# EAGLE design Pure Noise (EAGLE 8.7.0)
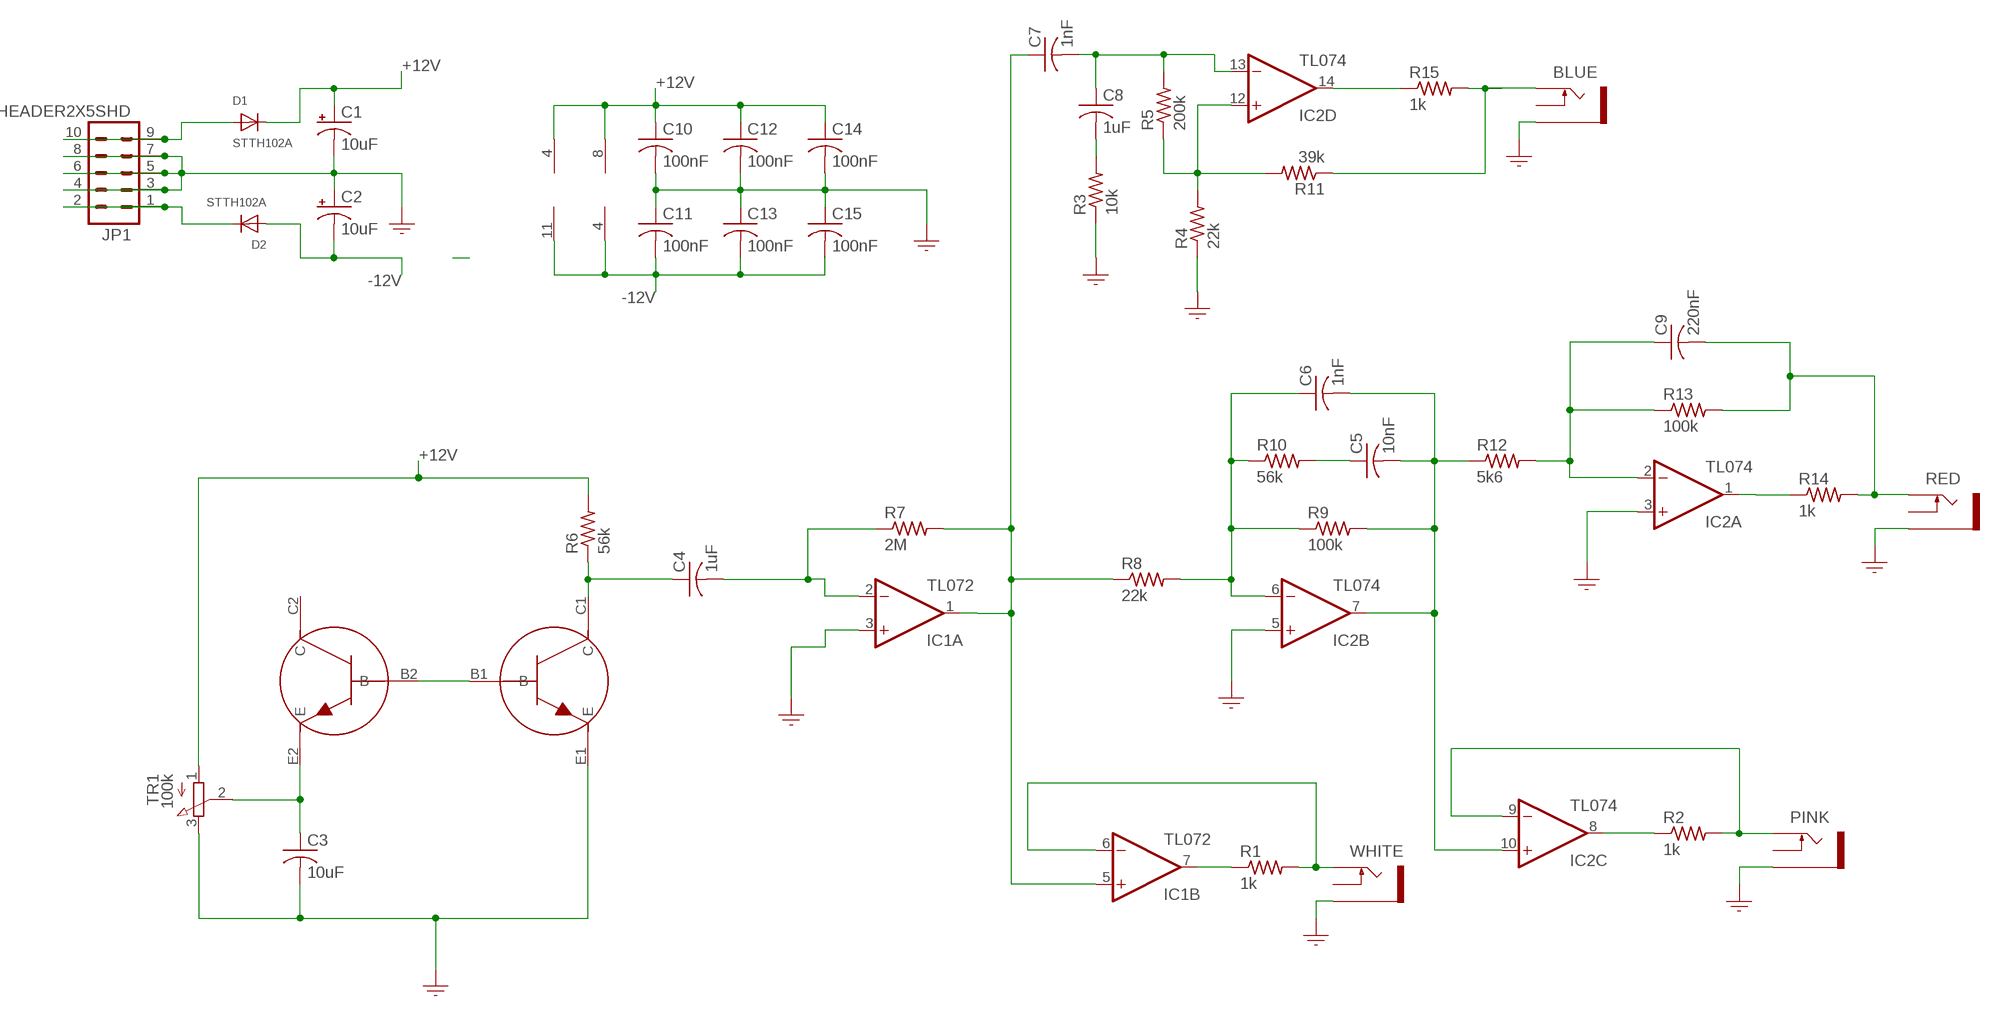
[diagram p0: schematic, sheet 1]

## Parts
BLUE  SOCKET_MONO_3.5MMPJ301M-12  [PJ301M-12]
C1  10uF  CAPACITOR_POL-US153CLV-0505  [153CLV-0505]
C2  10uF  CAPACITOR_POL-US153CLV-0505  [153CLV-0505]
C3  10uF  CAPACITOR-USC0805  [C0805]
C4  1uF  CAPACITOR-USC0805  [C0805]
C5  10nF  CAPACITOR-USC0805  [C0805]
C6  1nF  CAPACITOR-USC0805  [C0805]
C7  1nF  CAPACITOR-USC0805  [C0805]
C8  1uF  CAPACITOR-USC0805  [C0805]
C9  220nF  CAPACITOR-USC0805  [C0805]
C10  100nF  CAPACITOR-USC0805  [C0805]
C11  100nF  CAPACITOR-USC0805  [C0805]
C12  100nF  CAPACITOR-USC0805  [C0805]
C13  100nF  CAPACITOR-USC0805  [C0805]
C14  100nF  CAPACITOR-USC0805  [C0805]
C15  100nF  CAPACITOR-USC0805  [C0805]
D1  STTH102A  DIODESMA  [SMADIODE]
D2  STTH102A  DIODESMA  [SMADIODE]
IC1  TL072  OPAMP_DUALD  [SO08]
IC2  TL074  OPAMP_QUADD  [SO14]
JP1  HEADER2X5SHD  [2X5-SHROUDED]
PINK  SOCKET_MONO_3.5MMPJ301M-12  [PJ301M-12]
R1  1k  RESISTOR_USR0805  [R0805]
R2  1k  RESISTOR_USR0805  [R0805]
R3  10k  RESISTOR_USR0805  [R0805]
R4  22k  RESISTOR_USR0805  [R0805]
R5  200k  RESISTOR_USR0805  [R0805]
R6  56k  RESISTOR_USR0805  [R0805]
R7  2M  RESISTOR_USR0805  [R0805]
R8  22k  RESISTOR_USR0805  [R0805]
R9  100k  RESISTOR_USR0805  [R0805]
R10  56k  RESISTOR_USR0805  [R0805]
R11  39k  RESISTOR_USR0805  [R0805]
R12  5k6  RESISTOR_USR0805  [R0805]
R13  100k  RESISTOR_USR0805  [R0805]
R14  1k  RESISTOR_USR0805  [R0805]
R15  1k  RESISTOR_USR0805  [R0805]
RED  SOCKET_MONO_3.5MMPJ301M-12  [PJ301M-12]
T1  DMMT3904W-7-F  TRANSISTOR_PAIR_NPN  [TRANS_PAIR]
TR1  100k  RESISTOR_VARIABLETRIMMER_TH  [TRIMMER_TH]
WHITE  SOCKET_MONO_3.5MMPJ301M-12  [PJ301M-12]

## Nets
+12V: C1.+ C10.1 C12.1 C14.1 D1.C IC1.8(P:V+) IC2.4(P:V+) R6.2 TR1.1
-12V: C2.- C11.2 C13.2 C15.2 D2.A IC1.4(P:V-) IC2.11(P:V-)
BLUE: BLUE.TIP R11.1 R15.2
GND: BLUE.GND(SLEEVE) C1.- C2.+ C3.2 C10.2 C11.1 C12.2 C13.1 C14.2 C15.1 IC1.3(A:+IN) IC2.3(A:+IN) IC2.5(B:+IN) JP1.3 JP1.4 JP1.5 JP1.6 JP1.7 JP1.8 PINK.GND(SLEEVE) R3.1 R4.1 RED.GND(SLEEVE) T1.E1(E) TR1.3 WHITE.GND(SLEEVE)
N$1: IC1.7(B:OUT) R1.1
N$2: IC2.8(C:OUT) R2.1
N$3: C8.2 R3.2
N$4: C7.2 C8.1 IC2.13(D:-IN) R5.2
N$5: IC2.12(D:+IN) R4.2 R5.1 R11.2
N$6: C9.1 IC2.2(A:-IN) R12.2 R13.1
N$8: IC2.1(A:OUT) R14.1
N$9: D1.A JP1.9 JP1.10
N$10: D2.C JP1.1 JP1.2
N$11: IC2.14(D:OUT) R15.1
N$12: T1.B1(B) T1.B2(B)
N$13: C3.1 T1.E2(E) TR1.2
N$14: C4.1 R6.1 T1.C1(C)
N$15: C4.2 IC1.2(A:-IN) R7.1
N$16: C6.1 IC2.6(B:-IN) R8.2 R9.1 R10.1
N$17: C5.1 R10.2
N$19: C7.1 IC1.1(A:OUT) IC1.5(B:+IN) R7.2 R8.1
N$23: C5.2 C6.2 IC2.7(B:OUT) IC2.10(C:+IN) R9.2 R12.1
PINK: IC2.9(C:-IN) PINK.TIP R2.2
RED: C9.2 R13.2 R14.2 RED.TIP
WHITE: IC1.6(B:-IN) R1.2 WHITE.TIP
Unconnected: BLUE.NORM(SWITCH) PINK.NORM(SWITCH) RED.NORM(SWITCH) T1.C2(C) WHITE.NORM(SWITCH)

## Library data of the parts
BLUE PINK RED WHITE = GMSN:SOCKET_MONO_3.5MM: 3.5 mm Jack Socket; SORT: 8
C1 C2 = GMSN:CAPACITOR_POL-US: Electro Capacitor; SORT: 6
C3-C15 = GMSN:CAPACITOR-US: Capacitor; SORT: 3
D1 D2 = GMSN:DIODE: Diode SMADIODE - SMA Surface Mount Package 20V 1A Schottky Diode Digikey: 641-1014-6-ND DO-1N4148 - Through Hole Small Current Diode SOD-123 20V 1 A (.5mV Vf) Schottky Diode - Digikey: MBRX120TPMSCT-ND SOD-323 10V 570mA (.38mV Vf, 3ns) Schottky Diode - Digikey: ZLLS410CT-ND SOD-523 30V 30mA Schottky Diode (RB751S-40TE61) - Digikey: RB751S-40TE61CT-ND SOT23-R/W - SOT23 Package (R = Solder Paste/Reflow Ovens, W = Hand-Soldering) BAT54Film 40V 300mA - Digikey: 497-7162-1-ND; SORT: 1
IC1 = GMSN:OPAMP_DUAL: OP AMP; SORT: 4
IC2 = GMSN:OPAMP_QUAD: OP AMP; SORT: 4
JP1 = GMSN:HEADER2X5: Header 5x2 Standard 10-pin dual row 0.1" header. Commonly used with AVR-ISP. Use with Spark Fun Electronics SKU: PRT-00778; SORT: 7
R1-R15 = GMSN:RESISTOR_US: Resistor; SORT: 2
T1 = GMSN:TRANSISTOR_PAIR_NPN: NPN Transistor Matched Pair; SORT: 4
TR1 = GMSN:RESISTOR_VARIABLE: Potentiometer; SORT: 7

## Board
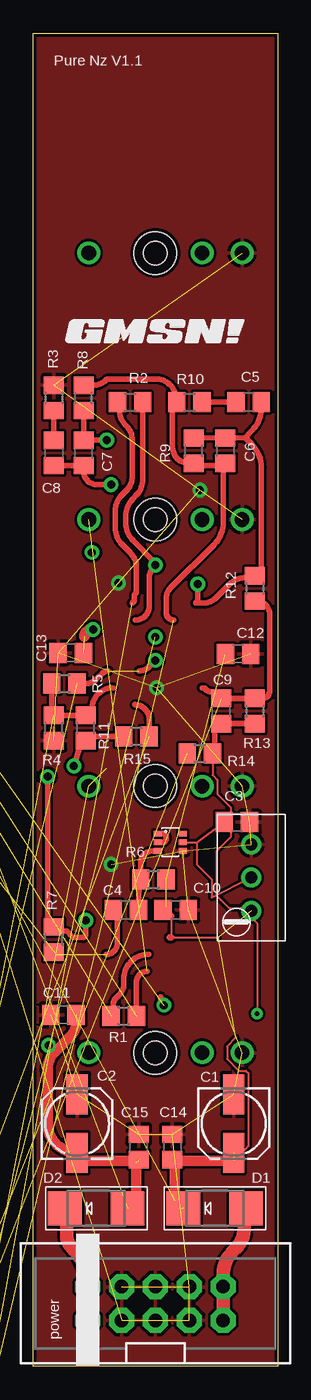
[diagram p1: board, top side]
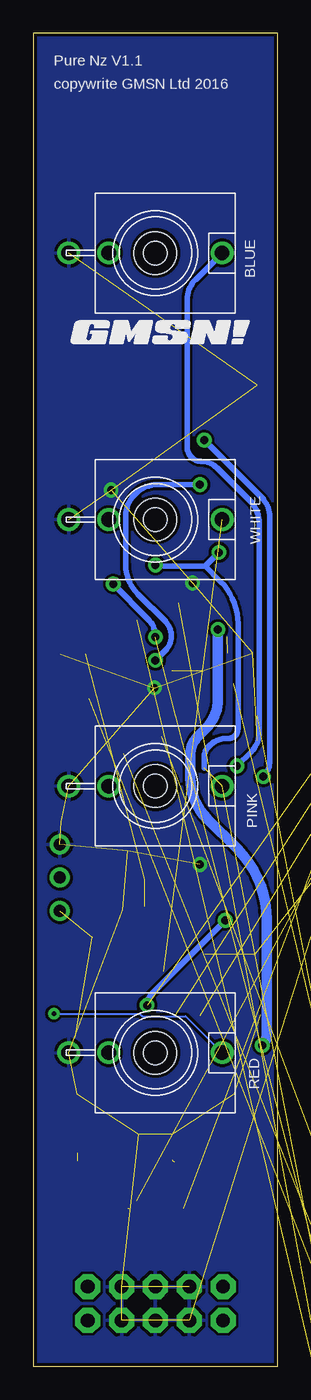
[diagram p2: board, bottom side, seen from below]

Size 18.32 x 100 mm. Coordinates in mm from the lower left corner, seen from the top.
Outline: 18.32,0 0,0 0,100 18.32,100 18.32,0
Copper layers (1*16): Top 0.035mm / dielectric 1.5mm / Bottom 0.035mm
Design rules "SparkFun": minimum track width 8mil, minimum drill 20mil, track to track 8mil, track to pad 8mil, pad to pad 8mil, via to via 8mil, smd to smd 8mil, copper to edge 10mil, drill to drill 8mil, minimum pad ring 12mil, minimum via ring 10mil, stop-mask expansion 4mil, vias tented up to drill 25mil, thermal gap 10mil
Holes 3.2 mm at 9.16,83.52 9.16,63.52 9.16,43.52 9.16,23.52

### Footprints (pad centres in the part's own frame; a part is rotated, then mirrored left to right if it is on the bottom)
PJ301M-12 = drill 1.1: GND 0,-6.5; NORM 0,-3.5; TIP 0,5 | hole 1.778: 0,0
153CLV-0505 = smd 3 x 1.6: + 2.2,0; - -2.2,0
C0805 = smd 1.3 x 1.5: 1 -0.95,0; 2 0.95,0
SMADIODE = smd 2.54 x 2.54: A 2.349,0; C -2.349,0
SO08 = smd 0.6 x 2.2: 1 -1.905,-2.6; 2 -0.635,-2.6; 3 0.635,-2.6; 4 1.905,-2.6; 5 1.905,2.6; 6 0.635,2.6; 7 -0.635,2.6; 8 -1.905,2.6
SO14 = smd 0.6 x 2.2: 1 -3.81,-2.6; 2 -2.54,-2.6; 3 -1.27,-2.6; 4 0,-2.6; 5 1.27,-2.6; 6 2.54,-2.6; 7 3.81,-2.6; 8 3.81,2.6; 9 2.54,2.6; 10 1.27,2.6; 11 0,2.6; 12 -1.27,2.6; 13 -2.54,2.6; 14 -3.81,2.6
2X5-SHROUDED = drill 1.016 pad 1.88 octagon: 1 -1.27,5.08; 2 1.27,5.08; 3 -1.27,2.54; 4 1.27,2.54; 5 -1.27,0; 6 1.27,0; 7 -1.27,-2.54; 8 1.27,-2.54; 9 -1.27,-5.08; 10 1.27,-5.08
R0805 = smd 1.3 x 1.5: 1 -0.95,0; 2 0.95,0
TRANS_PAIR = smd 0.42 x 0.6: B1 0,-0.95; B2 -0.65,-0.95; C1 0.65,-0.95; C2 -0.65,0.95; E1 0.65,0.95; E2 0,0.95
TRIMMER_TH = drill 0.9: 1 -0.802,1.143; 2 -3.302,1.143; 3 -5.802,1.143

### Placement (x,y rotation side)
BLUE  9.16,83.52 270 bottom
C1  15.03,18.19 270 top
C2  3.29,18.19 90 top
C3  15.27,40.82 0 top
C4  6.94,34.23 180 top
C5  16.14,72.33 0 top
C6  14.4,68.68 90 top
C7  3.76,68.52 270 top
C8  1.54,68.52 90 top
C9  14.08,49.15 270 top
C10  10.67,34.23 0 top
C11  2.25,26.37 0 top
C12  15.35,53.44 0 top
C13  2.81,53.52 0 top
C14  10.43,16.45 90 top
C15  7.89,16.45 270 top
D1  13.61,11.84 0 top
D2  4.71,11.84 0 top
IC1  -6.08,44.23 0 top  (outside the outline)
IC2  -8.62,-11.65 0 top  (outside the outline)
JP1  9.16,4.7 90 top
PINK  9.16,43.52 270 bottom
R1  6.78,26.29 0 top
R2  7.26,72.33 0 top
R3  1.54,72.65 270 top
R4  1.54,47.88 90 top
R5  2.33,51.21 0 top
R6  9,36.53 0 top
R7  1.54,32.01 90 top
R8  3.76,72.65 90 top
R9  12.02,68.68 90 top
R10  11.7,72.33 0 top
R11  3.92,47.88 90 top
R12  16.62,58.36 270 top
R13  16.62,49.15 270 top
R14  12.49,45.98 0 top
R15  7.73,47.25 180 top
RED  9.16,23.52 270 bottom
T1  10.27,39.31 270 top
TR1  15.19,33.36 270 top
U$2  [GMSN!_LOGO]  8.53,77.49 0 bottom
U$3  [GMSN!_LOGO]  9.4,77.57 0 top
WHITE  9.16,63.52 270 bottom

### Tracks (layer width: path | path; a pad name or v marks a point on that pad's centre or on a via)
+12V  (8 unrouted)
  Top 0.152: 10.35,32.17 13.88,32.17 | 15.19,24.66 14.53,23.99 14.53,23.05 15.4,22.17 15.95,22.17 16.11,22.01 16.11,16.5 15.03,15.42 | 10.35,33.8 10.35,32.29 10.22,32.17 | 9.95,34.51 C10.1
  Top 0.5: 10.22,32.17 10.35,32.17 | C10.1 10.35,33.8
  Top 0.8: 11.14,11.84 10.59,12.4 10.59,15.29 C14.1 10.46,15.42 15.03,15.42
-12V  (via drill 0.6)  (6 unrouted)
  Top 0.8: 7.73,15.29 7.73,11.92 7.65,11.84 D2.A | 7.86,15.42 3.37,15.42 3.29,15.5 C2.- 3.23,16.05 arc-90 1.06,18.22 1.06,22.23 arc-45 1.63,23.61 1.74,23.71 | 3.25,25.87 arc-45 2.8,24.77 1.74,23.71 | 3.81,54.75 arc-45 4.15,55.25 v4.48,55.26 | v1.14,24.07 1.5,23.71 1.74,23.71
  Bottom 0.8: v4.48,55.26 4.48,50.04 arc45 5.38,47.85 5.97,47.26 arc-45 6.54,45.89 6.54,44.11 arc-45 5.28,41.06 3.04,38.83 arc45 0.83,33.47 0.83,24.83 arc45 v1.14,24.07
BLUE  (via drill 0.6)
  Top 0.4: R15.2 4.24,47.25 R11.1 3.52,46.53 v3.05,45.02
  Bottom 0.4: v3.05,45.02 1.99,46.08 arc-45 1.38,47.55 1.38,63.22 arc-45 2.1,64.95 4.55,67.4 arc-45 5.71,67.88 arc90 6.78,68.95 6.78,80.01 arc45 6.15,81.53 BLUE.TIP
GND  (via drill 0.6)  (29 unrouted)
  other vias: 5.83,37.64 9.24,50.9 6.38,58.76 12.49,65.74
  pour Top: 18.32,100 0,100 0,0 18.32,0
  pour Bottom: 18.32,100 0,100 0,0 18.32,0
N$1  (1 unrouted)
  Top 0.4: 8.64,30.89 arc90 6.78,29.04 6.78,28.62 arc-45 6.48,27.89 6.2,27.62 arc45 5.99,27.09 5.99,26.45 R1.1
N$2  (1 unrouted)
  Top 0.4: 6.14,72.01 6.3,72.17 R2.1 6.46,72.17 6.46,71.68 arc45 6.9,70.62 6.99,70.53 arc-45 7.41,69.51 7.41,66.74 arc-45 6.99,65.71 6.61,65.33 arc45 6.14,64.21 6.14,62.89 arc45 6.66,61.66 7.27,61.04 arc-45 7.73,59.93 7.73,58.17 arc-45 7.64,57.95 arc45 7.57,57.79 7.57,57.41 7.41,57.25
N$3
  Top 0.4: R3.2 C8.2
N$4  (via drill 0.6)  (2 unrouted)
  Top 0.4: R5.2 3.93,51.21 arc45 4.73,51.55 5.16,51.98 arc-45 5.62,52.17 | C8.1 C7.2 3.76,67.15 arc90 4.78,66.14 v5.83,66.14 | 7.93,52.17 arc45 8.68,52.48 v9.16,52.96
  Bottom 0.4: v9.16,52.96 8.41,53.71 arc-90 8.41,55.86 10.49,57.94 arc45 11.38,60.09 11.38,63.78 arc90 9.02,66.14 v5.83,66.14
N$5  (1 unrouted)
  Top 0.4: 5.99,50.9 arc90 4.4,49.31 R11.2 R4.2 1.38,48.99 R5.1
N$6  (1 unrouted)
  Top 0.4: 12.66,50.9 arc-45 12.91,50.79 12.94,50.77 arc45 13.39,50.58 13.65,50.58 C9.1 14.13,50.1 R13.1 17.17,50.1 arc90 17.73,50.66 17.73,56.39 arc90 16.72,57.41 R12.2
N$8  (1 unrouted)
  Top 0.4: 11.58,46.01 R14.1
N$9
  Top 1.016: JP1.9 JP1.10 14.24,6.91 arc-45 14.93,8.56 15.15,8.79 arc45 15.83,10.42 15.83,11.72 D1.A
N$10
  Top 1.016: JP1.1 JP1.2 4.08,5.99 arc45 2.86,8.94 arc-45 2.49,9.82 2.49,11.72 D2.C
N$11  (1 unrouted)
  Top 0.4: 7.62,49.63 arc-90 8.68,48.56 R15.1
N$12
  Top 0.4: T1.B1 9.79,39.31 9.88,39.39 arc90 9.88,39.86 9.78,39.96 T1.B2
N$13
  Top 0.152: T1.E2 12.26,39.31 | 12.26,39.31 C3.1 | 12.26,39.31 12.26,37.63 13.37,36.53 13.37,35.18 TR1.2
N$14
  Top 0.4: C4.1 7.94,36.8 R6.1 8.05,37.01 8.05,37.77 arc-90 8.94,38.66 T1.C1
N$15  (2 unrouted)
  Top 0.4: 1.7,30.89 R7.1 | 5.46,30.89 arc90 6.3,31.74 6.3,33.86 C4.2
N$16  (1 unrouted)
  Top 0.4: R8.2 4.54,73.6 arc45 5.38,73.94 arc-45 5.7,74.08 9.16,74.08 arc-90 10.75,72.49 R10.1 10.43,72.01 10.43,69.01 arc90 11.71,67.73 R9.1 12.18,67.57 14.24,67.57 | C6.1 14.24,67.57 | 14.24,67.57 14.24,63.3 arc-45 13.56,61.64 10.29,58.37 arc45 9.95,57.57 9.95,56.55 arc90 10.53,55.98 | 14.24,67.57 14.29,67.57 C6.1
N$17
  Top 0.4: C5.1 R10.2
N$19  (via drill 0.6)  (2 unrouted)
  Top 0.4: R8.1 C7.1 3.81,69.47 v5.51,69.47 | 9.54,27.71 arc45 v9.79,27.08 | v3.92,33.44 3.92,32.32 3.76,32.17 2.97,32.17 2.49,32.64 1.85,32.64 R7.2 1.22,33.28 1.06,33.28 v1.06,44.23
  Bottom 0.4: v9.79,27.08 arc45 9.46,27.9 v3.92,33.44 | v1.06,44.23 arc-45 0.59,45.38 0.59,63.73 arc-45 1.17,65.13 v5.51,69.47
N$23  (via drill 0.6)  (2 unrouted)
  Top 0.4: R9.2 12.07,69.68 C6.2 15.88,69.68 | 15.88,69.68 16.41,70.21 arc45 17.1,71.87 17.1,72.28 C5.2 | 15.88,69.68 16.39,69.17 arc-45 17.1,67.45 17.1,59.79 R12.1 16.46,59.15 15.82,59.15 arc45 14.75,58.71 13.69,57.64 arc-45 12.73,57.25 12.18,57.25 12.34,57.41 v12.34,58.68
  Bottom 0.4: v9.16,54.71 arc-45 9.72,56.06 v12.34,58.68
PINK  (via drill 0.6)  (2 unrouted)
  Top 0.4: R2.2 8.21,66.53 arc-45 7.7,65.31 7.46,65.07 arc45 6.94,63.81 6.94,63.25 arc45 7.48,61.94 9.05,60.38 arc-45 v9.16,60.1
  Top 0.406: 7.65,55.98 arc90 8.68,57.01 8.68,59.13 arc-45 9.03,59.98 v9.16,60.1
  Bottom 0.4: 5.51,44.87 5.51,45.7 arc45 5.2,46.44 5,46.65 arc45 3.93,47.09 3.72,47.09 arc-90 2.97,47.84 2.97,55.7 arc-45 4.28,58.88 5.43,60.03 | 5.43,60.03 9.08,60.03 v9.16,60.1 | v4.4,61.06 5.43,60.03
RED  (via drill 0.35)
  Top 0.152: R14.2 13.44,44.34 13.79,43.99 13.79,42.94 14.8,41.93 14.8,39.7 13.72,38.62 13.72,35.33 14.66,34.39 15.62,34.39 16.78,33.23 v16.78,26.45
  Top 0.4: R13.2 14.13,48.2 C9.2 13.88,48.15 13.61,47.88 13.61,46.14 R14.2
  Bottom 0.152: v16.78,26.45 10.34,26.45 10.14,26.25 6.89,26.25 RED.TIP
WHITE  (2 unrouted)
  Top 0.4: 8.53,29.62 arc90 7.73,28.83 R1.2

### Text on the board
tPlace: Pure Nz V1.1 | power
bPlace: Pure Nz V1.1 | copywrite GMSN Ltd 2016